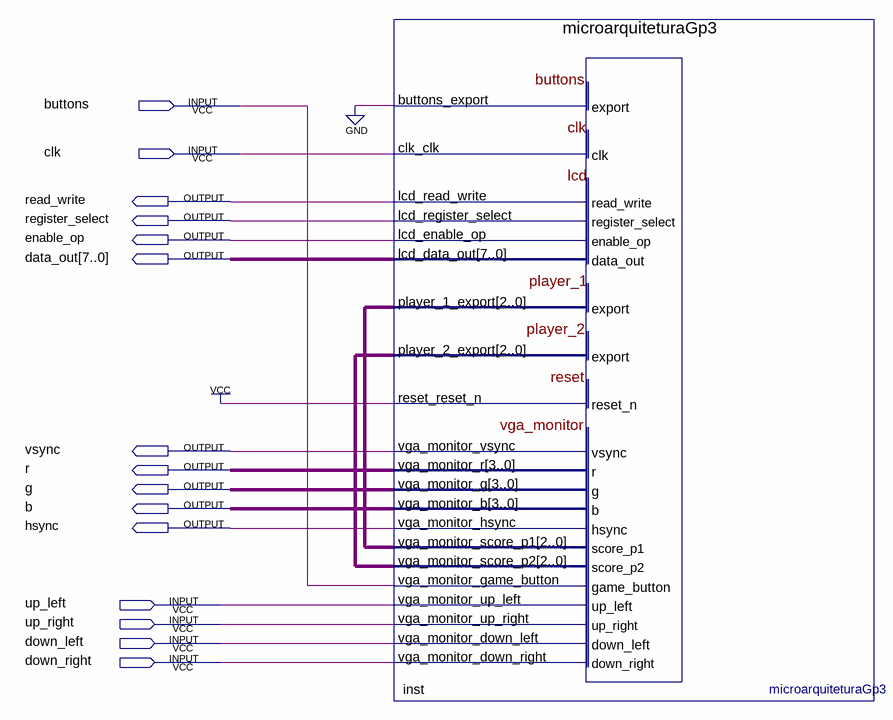
[diagram p0: schematic sheet]
// Quartus schematic pong.bdf as structural Verilog: 1 symbols, 15 pins
module pong (
  input  buttons,
  input  clk,
  input  up_left,
  input  up_right,
  input  down_left,
  input  down_right,
  output read_write,
  output register_select,
  output enable_op,
  output [7:0] data_out,
  output vsync,
  output r,
  output g,
  output b,
  output hsync
);

  wire [2:0] inst_vga_monitor_score_p1, inst_vga_monitor_score_p2;
  wire [3:0] inst_vga_monitor_b, inst_vga_monitor_g, inst_vga_monitor_r;

  microarquiteturaGp3 inst (
    .buttons_export(1'b0), .clk_clk(clk), .player_1_export(inst_vga_monitor_score_p1),
    .player_2_export(inst_vga_monitor_score_p2), .reset_reset_n(1'b1), .vga_monitor_game_button(buttons),
    .vga_monitor_up_left(up_left), .vga_monitor_up_right(up_right), .vga_monitor_down_left(down_left),
    .vga_monitor_down_right(down_right), .lcd_read_write(read_write), .lcd_register_select(register_select),
    .lcd_enable_op(enable_op), .lcd_data_out(data_out), .vga_monitor_vsync(vsync),
    .vga_monitor_r(inst_vga_monitor_r), .vga_monitor_g(inst_vga_monitor_g),
    .vga_monitor_b(inst_vga_monitor_b), .vga_monitor_hsync(hsync),
    .vga_monitor_score_p1(inst_vga_monitor_score_p1), .vga_monitor_score_p2(inst_vga_monitor_score_p2));
endmodule
